# Altium schematic sheet uC_General.SchDoc: Microcontrolador SAMG55
size A4; Author: **; CompanyName: Introducción al Diseño de Circuitos Impresos; Organization: UTN FRBA; DocumentNumber: 2; Revision: 01; SheetNumber: 2; SheetTotal: 9; Autor: Eugenia Ipar
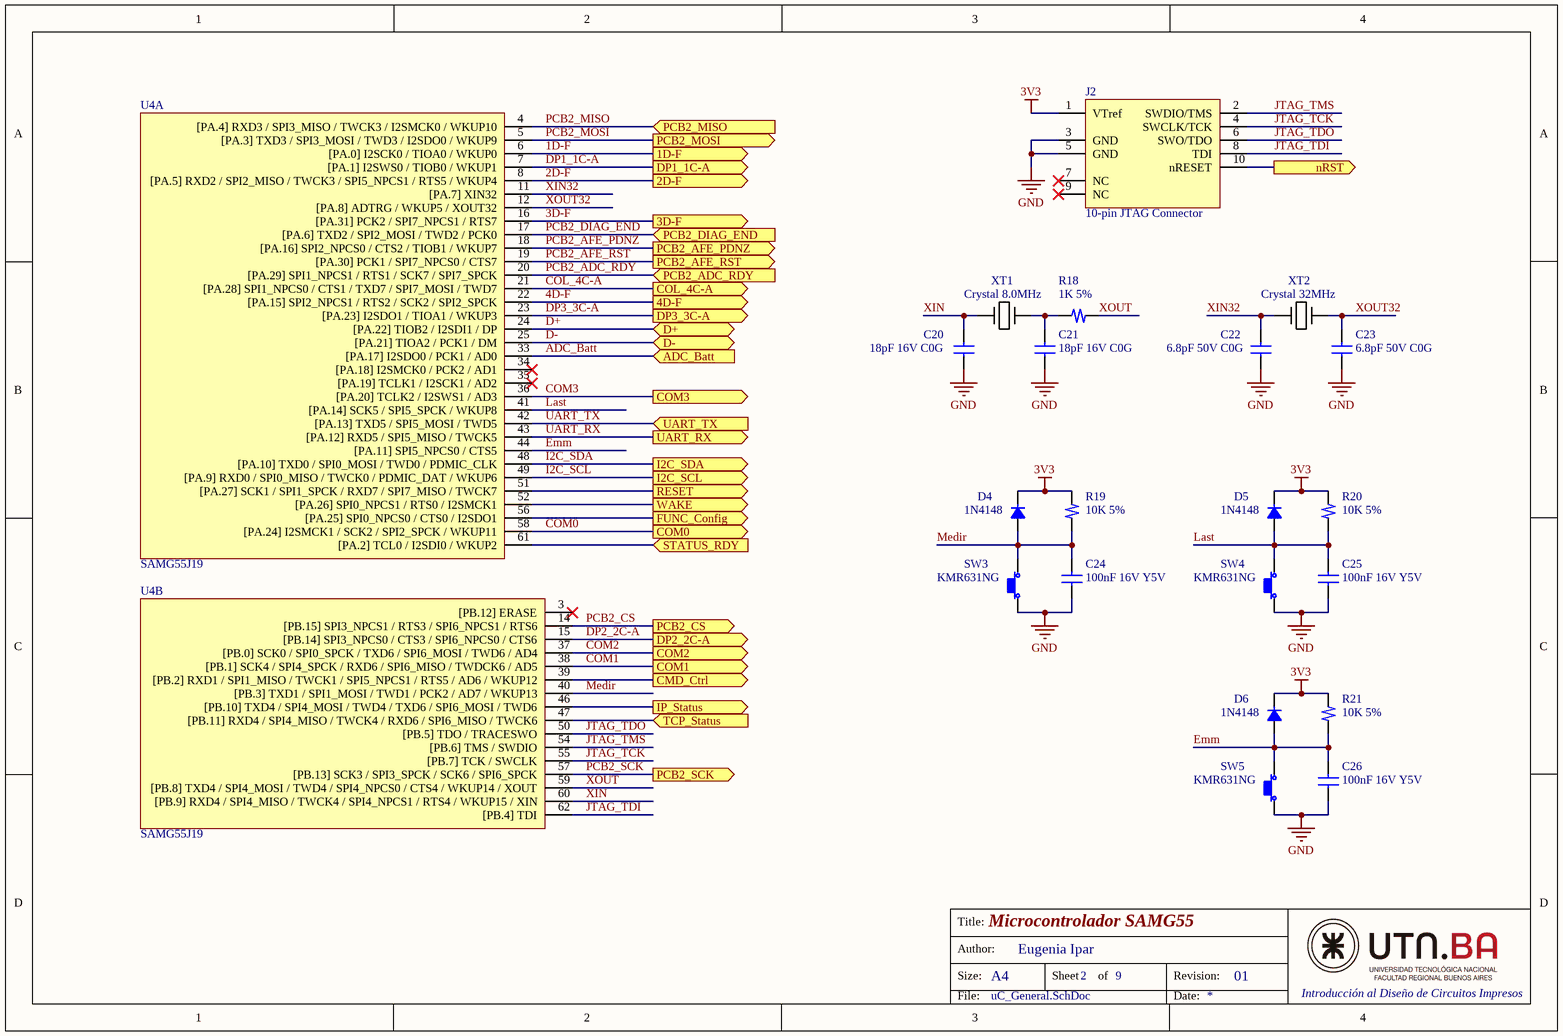
[diagram p0: uC_General.SchDoc]

## Parts
C20  18pF 16V C0G  [C_0402]
C21  18pF 16V C0G  [C_0402]
C22  6.8pF 50V C0G  [C_0402]
C23  6.8pF 50V C0G  [C_0402]
C24  100nF 16V Y5V  [C_0402]
C25  100nF 16V Y5V  [C_0402]
C26  100nF 16V Y5V  [C_0402]
D4  1N4148  [SOD523]
D5  1N4148  [SOD523]
D6  1N4148  [SOD523]
J2  10-pin JTAG Connector  [JTAG HEADER]
R18  1K 5%  [R_0402]
R19  10K 5%  [R_0402]
R20  10K 5%  [R_0402]
R21  10K 5%  [R_0402]
SW3  KMR631NG  [TACT SWITCH]
SW4  KMR631NG  [TACT SWITCH]
SW5  KMR631NG  [TACT SWITCH]
U4  SAMG55J19  [LQFP 64]  (parts A,B of 4)
XT1  Crystal 8.0MHz  [CRYSTAL_8]
XT2  Crystal 32MHz  [FC-135]

## Ports
1D-F (out), 2D-F (out), 3D-F (out), 4D-F (out), ADC_Batt (in), CMD_Ctrl (out), COL_4C-A (out), COM0 (out), COM1 (out), COM2 (out), COM3 (out), D+ (bidir), D- (bidir), DP1_1C-A (out), DP2_2C-A (out), DP3_3C-A (out), FUNC_Config (out), I2C_SCL (out), I2C_SDA (out), IP_Status (out), nRST (out), PCB2_ADC_RDY (in), PCB2_AFE_PDNZ (out), PCB2_AFE_RST (out), PCB2_CS (out), PCB2_DIAG_END (in), PCB2_MISO (in), PCB2_MOSI (out), PCB2_SCK (out), RESET (out), STATUS_RDY (in), TCP_Status (in), UART_RX (out), UART_TX (in), WAKE (out)

## Nets
3V3: D4.2 D5.2 D6.2 J2.1(VTref) R19.2 R20.2 R21.2
GND: C20.2 C21.2 C22.2 C23.2 C24.2 C25.2 C26.2 J2.3(GND) J2.5(GND) SW3.1 SW4.1 SW5.1
1D-F: U4.6([PA.0]_I2SCK0_/_TIOA0_/_WKUP0) ; port 1D-F
2D-F: U4.8([PA.5]_RXD2_/_SPI2_MISO_/_TWCK3_/_SPI5_NPCS1_/_RTS5_/_WKUP4) ; port 2D-F
3D-F: U4.16([PA.31]_PCK2_/_SPI7_NPCS1_/_RTS7) ; port 3D-F
4D-F: U4.22([PA.15]_SPI2_NPCS1_/_RTS2_/_SCK2_/_SPI2_SPCK) ; port 4D-F
ADC_Batt: U4.33([PA.17]_I2SDO0_/_PCK1_/_AD0) ; port ADC_Batt
CMD_Ctrl: U4.39([PB.2]_RXD1_/_SPI1_MISO_/_TWCK1_/_SPI5_NPCS1_/_RTS5_/_AD6_/_WKUP12) ; port CMD_Ctrl
COL_4C-A: U4.21([PA.28]_SPI1_NPCS0_/_CTS1_/_TXD7_/_SPI7_MOSI_/_TWD7) ; port COL_4C-A
COM0: U4.58([PA.24]_I2SMCK1_/_SCK2_/_SPI2_SPCK_/_WKUP11) ; port COM0
COM1: U4.38([PB.1]_SCK4_/_SPI4_SPCK_/_RXD6_/_SPI6_MISO_/_TWDCK6_/_AD5) ; port COM1
COM2: U4.37([PB.0]_SCK0_/_SPI0_SPCK_/_TXD6_/_SPI6_MOSI_/_TWD6_/_AD4) ; port COM2
COM3: U4.36([PA.20]_TCLK2_/_I2SWS1_/_AD3) ; port COM3
D+: U4.24([PA.22]_TIOB2_/_I2SDI1_/_DP) ; port D+
D-: U4.25([PA.21]_TIOA2_/_PCK1_/_DM) ; port D-
DP1_1C-A: U4.7([PA.1]_I2SWS0_/_TIOB0_/_WKUP1) ; port DP1_1C-A
DP2_2C-A: U4.15([PB.14]_SPI3_NPCS0_/_CTS3_/_SPI6_NPCS0_/_CTS6) ; port DP2_2C-A
DP3_3C-A: U4.23([PA.23]_I2SDO1_/_TIOA1_/_WKUP3) ; port DP3_3C-A
Emm: C26.1 D6.1 R21.1 SW5.2 U4.44([PA.11]_SPI5_NPCS0_/_CTS5)
FUNC_Config: U4.56([PA.25]_SPI0_NPCS0_/_CTS0_/_I2SDO1) ; port FUNC_Config
I2C_SCL: U4.49([PA.9]_RXD0_/_SPI0_MISO_/_TWCK0_/_PDMIC_DAT_/_WKUP6) ; port I2C_SCL
I2C_SDA: U4.48([PA.10]_TXD0_/_SPI0_MOSI_/_TWD0_/_PDMIC_CLK) ; port I2C_SDA
IP_Status: U4.46([PB.10]_TXD4_/_SPI4_MOSI_/_TWD4_/_TXD6_/_SPI6_MOSI_/_TWD6) ; port IP_Status
JTAG_TCK: J2.4(SWCLK/TCK) U4.55([PB.7]_TCK_/_SWCLK)
JTAG_TDI: J2.8(TDI) U4.62([PB.4]_TDI)
JTAG_TDO: J2.6(SWO/TDO) U4.50([PB.5]_TDO_/_TRACESWO)
JTAG_TMS: J2.2(SWDIO/TMS) U4.54([PB.6]_TMS_/_SWDIO)
Last: C25.1 D5.1 R20.1 SW4.2 U4.41([PA.14]_SCK5_/_SPI5_SPCK_/_WKUP8)
Medir: C24.1 D4.1 R19.1 SW3.2 U4.40([PB.3]_TXD1_/_SPI1_MOSI_/_TWD1_/_PCK2_/_AD7_/_WKUP13)
nRST: J2.10(nRESET) ; port nRST
PCB2_ADC_RDY: U4.20([PA.29]_SPI1_NPCS1_/_RTS1_/_SCK7_/_SPI7_SPCK) ; port PCB2_ADC_RDY
PCB2_AFE_PDNZ: U4.18([PA.16]_SPI2_NPCS0_/_CTS2_/_TIOB1_/_WKUP7) ; port PCB2_AFE_PDNZ
PCB2_AFE_RST: U4.19([PA.30]_PCK1_/_SPI7_NPCS0_/_CTS7) ; port PCB2_AFE_RST
PCB2_CS: U4.14([PB.15]_SPI3_NPCS1_/_RTS3_/_SPI6_NPCS1_/_RTS6) ; port PCB2_CS
PCB2_DIAG_END: U4.17([PA.6]_TXD2_/_SPI2_MOSI_/_TWD2_/_PCK0) ; port PCB2_DIAG_END
PCB2_MISO: U4.4([PA.4]_RXD3_/_SPI3_MISO_/_TWCK3_/_I2SMCK0_/_WKUP10) ; port PCB2_MISO
PCB2_MOSI: U4.5([PA.3]_TXD3_/_SPI3_MOSI_/_TWD3_/_I2SDO0_/_WKUP9) ; port PCB2_MOSI
PCB2_SCK: U4.57([PB.13]_SCK3_/_SPI3_SPCK_/_SCK6_/_SPI6_SPCK) ; port PCB2_SCK
RESET: U4.51([PA.27]_SCK1_/_SPI1_SPCK_/_RXD7_/_SPI7_MISO_/_TWCK7) ; port RESET
STATUS_RDY: U4.61([PA.2]_TCL0_/_I2SDI0_/_WKUP2) ; port STATUS_RDY
TCP_Status: U4.47([PB.11]_RXD4_/_SPI4_MISO_/_TWCK4_/_RXD6_/_SPI6_MISO_/_TWCK6) ; port TCP_Status
UART_RX: U4.43([PA.12]_RXD5_/_SPI5_MISO_/_TWCK5) ; port UART_RX
UART_TX: U4.42([PA.13]_TXD5_/_SPI5_MOSI_/_TWD5) ; port UART_TX
WAKE: U4.52([PA.26]_SPI0_NPCS1_/_RTS0_/_I2SMCK1) ; port WAKE
XIN: C20.1 U4.60([PB.9]_RXD4_/_SPI4_MISO_/_TWCK4_/_SPI4_NPCS1_/_RTS4_/_WKUP15_/_XIN) XT1.1(IN)
XIN32: C22.1 U4.11([PA.7]_XIN32) XT2.1(IN)
XOUT: R18.2 U4.59([PB.8]_TXD4_/_SPI4_MOSI_/_TWD4_/_SPI4_NPCS0_/_CTS4_/_WKUP14_/_XOUT)
XOUT32: C23.1 U4.12([PA.8]_ADTRG_/_WKUP5_/_XOUT32) XT2.2(OUT)
NetC21_1: C21.1 R18.1 XT1.2(OUT)

Not connected (* = marked no-connect by the designer): J2 7(NC)* 9(NC)*; U4 3([PB.12]_ERASE)* 34([PA.18]_I2SMCK0_/_PCK2_/_AD1)* 35([PA.19]_TCLK1_/_I2SCK1_/_AD2)*

## Notes on the sheet
- Title:
- Size:
- Author:
- A4
- Sheet
- of
- Revision:
- File:
- Date:

## Library data of the parts
C20-C26 = Ceramic Capacitor: Ceramic Capacitor SMD 0402
D4-D6 = Diode 1N4148: Diode 1N4148 SMD SOD523
J2 = JTAG Connector: JTAG Connector Micro Terminal Strip .050" 10pin 2row
R18-R21 = Resistor: Resistor SMD 0402
SW3-SW5 = Tact Switch
U4 = SAMG55J19: Atmel SMART SAM G55 Cortex M4 32-bit 64-lead LQFP
XT1 = Crystal 8MHz: Crystal Oscillator 8.0MHz 20ppm 18pF PN: ABM7-8.000MHZ-D2Y-T
XT2 = Crystal 32MHz: Crystal Oscillator 32.768KHz 20ppm 7.0 pF PN: FC-135 32.7680KA-AG0